# EAGLE design Microfan Controller (EAGLE 8.2.2)
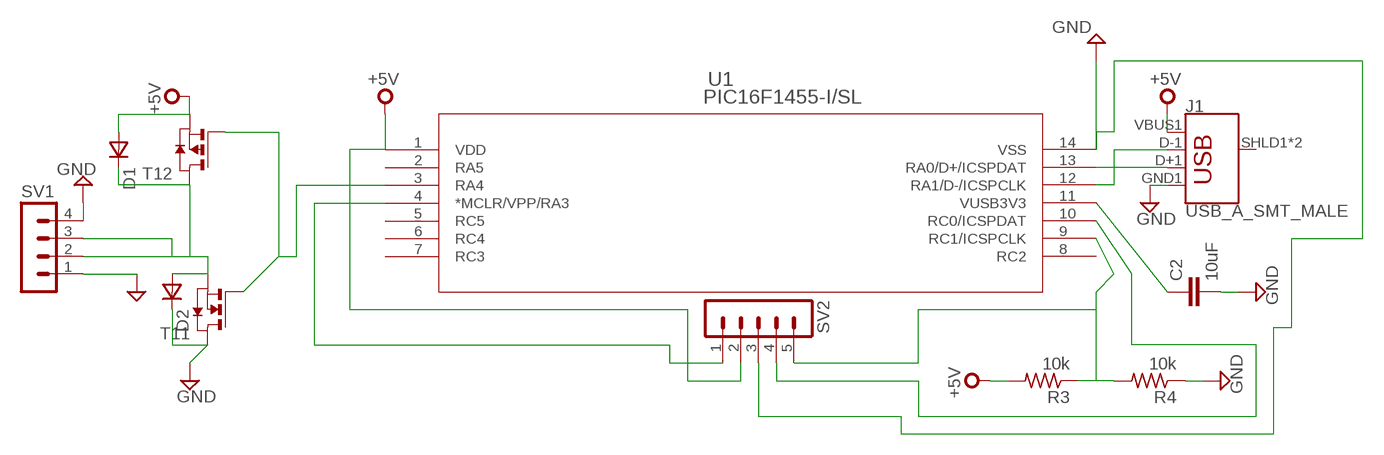
[diagram p0: schematic, sheet 1]

## Parts
C2  10uF  CSMT0805  [C0805]
D1  VAR2SOT23  [SOT-23]
D2  VAR2SOT23  [SOT-23]
J1  USB_A_SMT_MALE  [USB-A-SMT-MALE]
R3  10k  R-US_R0805  [R0805]
R4  10k  R-US_R0805  [R0805]
SV1  MA04-1  [MA04-1]
SV2  MA05-1  [MA05-1]
T1  PN_MOSFET-MSOP8  [MSOP8]
U1  PIC16F1455-I/SL  [SOIC14_SL]

## Nets
+5V [pwr]: D1.3(A) J1.VBUS1(VBUS) R3.2 SV2.2 T1.3(2:S) U1.1(VDD)
GND [pwr]: C2.2 D2.1(C) J1.GND1(GND) R4.1 SV1.1 SV1.4 T1.7(1:D) T1.8(1:D)
N$1: SV2.1 U1.4(*MCLR/VPP/RA3)
N$2: J1.D-1(D-) U1.12(RA1/D-/ICSPCLK)
N$3: T1.2(1:G) T1.4(2:G) U1.3(RA4)
N$5: R3.1 R4.2 SV2.5 U1.9(RC1/ICSPCLK)
N$6: D1.1(C) D2.3(A) SV1.2 SV1.3 T1.1(1:S) T1.5(2:D) T1.6(2:D)
N$7: J1.D+1(D+) U1.13(RA0/D+/ICSPDAT)
N$8: C2.1
N$10: SV2.3 U1.14(VSS)
N$13: SV2.4 U1.10(RC0/ICSPDAT)
Unconnected: J1.SHLD1(SHIELD) J1.SHLD2(SHIELD) U1.2(RA5) U1.5(RC5) U1.6(RC4) U1.7(RC3) U1.8(RC2)

## Power pins joined to a net without a drawn wire
VUSB3V3: U1.11(VUSB3V3)

## Library data of the parts
C2 = ee2parts:C: Capacitor
D1 D2 = zetex:VAR2SOT23: DIODE; OC_FARNELL: unknown; OC_NEWARK: unknown
J1 = SparkFun-Connectors:USB_A: USB-A Connector Male and female variants, as well as PTH and SMT variants SparkFun Products: SparkFun XBee Explorer Dongle <https://www.sparkfun.com/products/11697> PTH Male SparkFun MicroView-USB Programmer <https://www.sparkfun.com/products/12924> SMT Male SparkFun USB Type A Female Breakout <https://www.sparkfun.com/products/12700> SMT Female; PROD_ID: CONN-11499
R3 R4 = resistor:R-US_: RESISTOR, American symbol
SV1 = con-lstb:MA04-1: PIN HEADER; OC_FARNELL: unknown; OC_NEWARK: unknown
SV2 = con-lstb:MA05-1: PIN HEADER; OC_FARNELL: unknown; OC_NEWARK: unknown
T1 = zetex:PN_MOSFET-: DUAL N AND P-CHANNEL ENHANCEMENT MODE MOSFET Source: Data sheet <http://www.farnell.com/datasheets/1693880.pdf>; OC_FARNELL: unknown; OC_NEWARK: unknown
U1 = PIC16F1455:PIC16F1455-I/SL; COPYRIGHT: Copyright C 2015 Accelerated Designs. All rights reserved; MANUFACTURER_PART_NUMBER: pic16f1455isl; VENDOR: MICROCHIP

## Net classes
0 default: width 0.305 mm, clearance 0.305 mm
1 pwr: width 0.635 mm

## Board
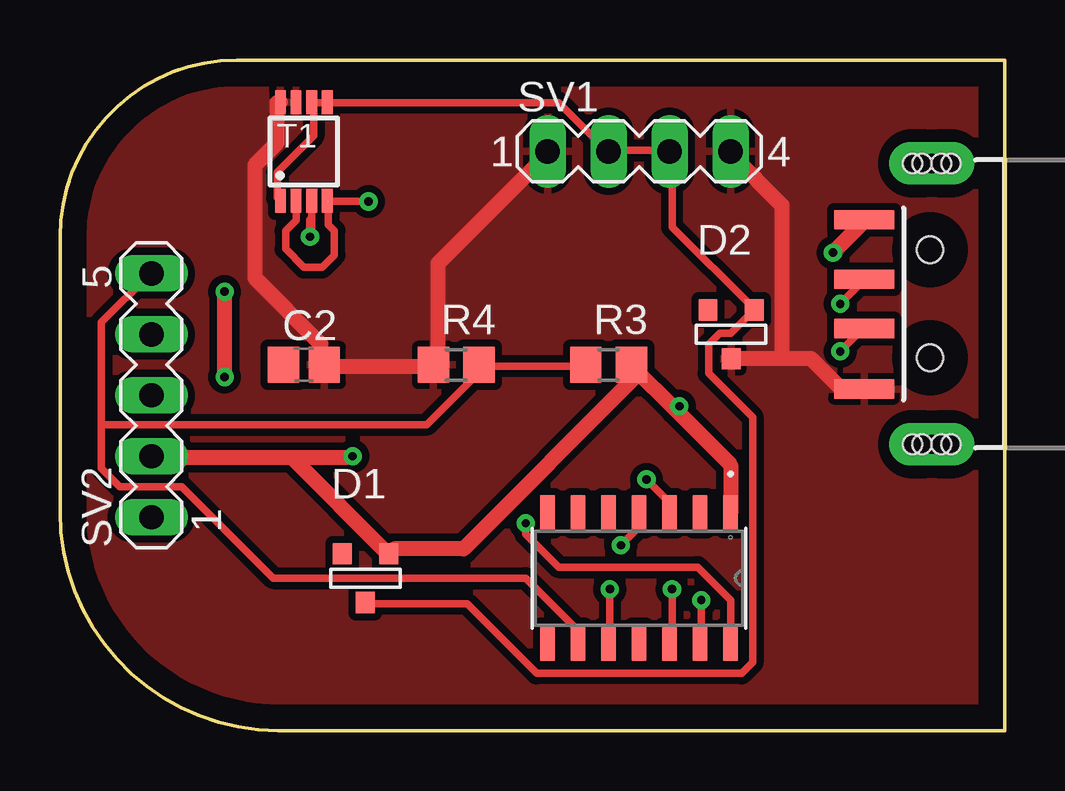
[diagram p1: board, top side]
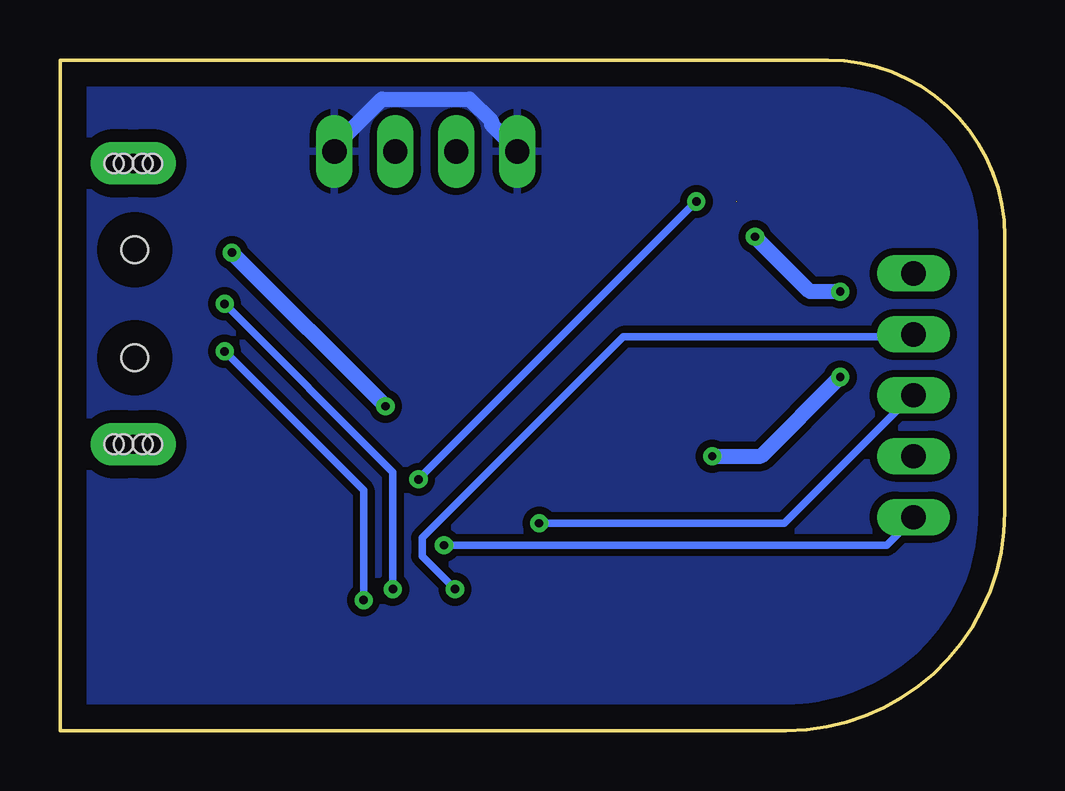
[diagram p2: board, bottom side, seen from below]

Size 39.37 x 27.94 mm. Coordinates in mm from the lower left corner, seen from the top.
Outline: 39.37,0 9.1,0 arc-90 0,9.1 0,20.57 arc-90 7.37,27.94 39.37,27.94 39.37,0
Copper layers (1*16): Top 0.035mm / dielectric 1.5mm / Bottom 0.035mm
Design rules "default *": minimum track width 12mil, minimum drill 0.35mm, track to track 12mil, track to pad 12mil, pad to pad 6mil, via to via 6mil, smd to smd 6mil, copper to edge 40mil, drill to drill 6mil, minimum pad ring 10mil, minimum via ring 8mil, stop-mask expansion 4mil, vias tented up to drill 0mil, thermal gap 10mil

### Footprints (pad centres in the part's own frame; a part is rotated, then mirrored left to right if it is on the bottom)
C0805 = smd 1.3 x 1.5: 1 -0.85,0; 2 0.85,0
SOT-23 = smd 0.787 x 0.889: 1 0.025,-1.016; 2 -0.94,1.016; 3 0.991,1.016
USB-A-SMT-MALE = smd 2.5 x 0.8: D+1 10.95,1.027; D-1 10.95,-1.027; GND1 10.95,3.551; VBUS1 10.95,-3.5 | drill 0.8 pad 1.778 long: SHLD1 8.13,-5.85; SHLD2 8.13,5.85 | hole 1.1: 8.2,2.25; 8.2,-2.25 | hole 0.8: 8.53,-5.85; 8.93,-5.85; 7.73,-5.85; 7.33,-5.85; 8.53,5.85; 8.93,5.85; 7.73,5.85; 7.33,5.85
R0805 = smd 1.3 x 1.5: 1 -0.95,0; 2 0.95,0
MA04-1 = drill 1.016 long: 1 -3.81,0; 2 -1.27,0; 3 1.27,0; 4 3.81,0
MA05-1 = drill 1.016 long: 1 -5.08,0; 2 -2.54,0; 3 0,0; 4 2.54,0; 5 5.08,0
MSOP8 = smd 0.45 x 1: 1 -0.975,-2.05; 2 -0.325,-2.05; 3 0.325,-2.05; 4 0.975,-2.05; 5 0.975,2.05; 6 0.325,2.05; 7 -0.325,2.05; 8 -0.975,2.05
SOIC14_SL = smd 1.5 x 0.6: 1 -2.7,3.81; 2 -2.7,2.54; 3 -2.7,1.27; 4 -2.7,0; 5 -2.7,-1.27; 6 -2.7,-2.54; 7 -2.7,-3.81; 8 2.7,-3.81; 9 2.7,-2.54; 10 2.7,-1.27; 11 2.7,0; 12 2.7,1.27; 13 2.7,2.54; 14 2.7,3.81

### Placement (x,y rotation side)
C2  10.16,15.24 0 top
D1  12.7,6.35 0 top
D2  27.94,16.51 0 top
J1  44.45,17.78 180 top
R3  22.86,15.24 0 top
R4  16.51,15.24 0 top
SV1  24.13,24.13 0 top
SV2  3.81,13.97 90 top
T1  10.16,24.13 0 top
U1  24.13,6.35 270 top

### Tracks (layer width: path | path; a pad name or v marks a point on that pad's centre or on a via)
+5V  (via drill 0.35)
  Top 0.305: 10.41,21.29 v10.41,20.57 10.48,20.64 T1.3
  Top 0.635: 9.65,11.38 13.61,7.42 D1.3 13.92,7.57 16.82,7.57 23.98,14.73 R3.2 23.82,15.19 25.65,13.36 | 9.65,11.38 3.86,11.38 SV2.2 | U1.1 27.94,11.07 25.65,13.36 | v32.21,19.91 33.43,21.13 J1.VBUS1 | v25.81,13.51 25.65,13.36 | 9.65,11.38 12.14,11.38 v12.19,11.43 | v6.86,14.73 v6.86,18.29
  Bottom 0.635: v25.81,13.51 v32.21,19.91 | v12.19,11.43 10.16,11.43 v6.86,14.73 | v6.86,18.29 8.13,18.29 v10.41,20.57
GND
  Top 0.635: T1.8 9.04,26.16 9.04,24.49 8.13,23.57 8.13,18.85 10.87,16.1 10.87,15.34 C2.2 11.33,15.19 15.44,15.19 R4.1 15.75,15.49 15.75,19.46 20.32,24.03 SV1.1 | 30.07,15.49 31.29,15.49 32.51,14.28 33.43,14.28 J1.GND1 | 30.07,15.49 D2.1 | 30.07,15.49 30.07,21.89 27.94,24.03 SV1.4
  Bottom 0.635: SV1.4 27.94,24.33 25.96,26.31 22.3,26.31 21.39,25.4 21.39,25.25 20.32,24.18 SV1.1
  pour Bottom: 39.37,0 9.1,0 arc-90 0,9.1 0,20.57 arc-90 7.37,27.94 39.37,27.94 39.37,0.25
  pour Top: 39.62,0 8.89,0 arc-90 0,8.89 0,20.57 arc-90 7.37,27.94 39.62,27.94
N$1  (via drill 0.35)
  Top 0.305: U1.4 24.13,8.48 v23.37,7.72
  Bottom 0.305: v23.37,7.72 4.93,7.72 3.86,8.79 SV2.1
N$2  (via drill 0.35)
  Top 0.305: v25.5,5.89 25.5,3.76 U1.12 | v32.51,17.78 33.43,18.69 J1.D-1
  Bottom 0.305: v25.5,5.89 25.5,10.77 v32.51,17.78
N$3  (via drill 0.35)  (1 unrouted)
  Top 0.305: v12.85,22.05 11.18,22.05 T1.4 | v24.43,10.46 25.35,9.55 25.35,9.09 U1.3 | T1.2 9.84,21.27 9.4,20.83 9.4,20.07 10.16,19.3 10.92,19.3 11.43,19.81 11.43,20.83 11.18,21.08 11.18,22.04 11.17,22.05
  Bottom 0.305: v24.43,10.46 v12.85,22.05
N$5
  Top 0.305: R3.1 21.84,15.19 17.58,15.19 R4.2 17.58,15.04 15.29,12.75 1.73,12.75 | 1.73,12.75 1.73,17.02 3.71,19 SV2.5 | 1.73,12.75 1.73,10.92 2.49,10.16 5.08,10.16 8.89,6.35 19.41,6.35 21.54,4.22 21.54,3.76 U1.9
N$6
  Top 0.305: 10.57,26.16 10.57,24.79 9.04,23.27 9.04,22.2 T1.1 | 10.57,26.16 T1.6 | 10.57,26.16 11.02,26.16 T1.5 11.18,26.16 20.78,26.16 22.76,24.18 SV1.2 22.91,24.18 25.35,24.18 SV1.3 25.5,24.03 25.5,20.98 28.85,17.63 D2.3 28.85,17.48 27.94,16.56 27.48,16.56 27.03,16.1 27.03,14.88 28.85,13.06 28.85,2.85 28.4,2.39 19.86,2.39 16.97,5.28 12.85,5.28 D1.1
N$7  (via drill 0.35)
  Top 0.305: v26.72,5.44 26.72,3.76 U1.13 | v32.51,15.8 33.43,16.71 J1.D+1
  Bottom 0.305: v26.72,5.44 26.72,10.01 v32.51,15.8
N$10  (via drill 0.35)
  Top 0.305: U1.14 27.94,5.44 26.57,6.81 20.78,6.81 19.41,8.18 v19.41,8.64
  Bottom 0.305: v19.41,8.64 9.2,8.64 3.86,13.97 SV2.3
N$13  (via drill 0.35)
  Top 0.305: v22.91,5.89 22.91,3.76 U1.10
  Bottom 0.305: v22.91,5.89 24.28,7.26 24.28,8.03 15.9,16.41 3.86,16.41 SV2.4